# EAGLE schematic lora (EAGLE 6.5.0)
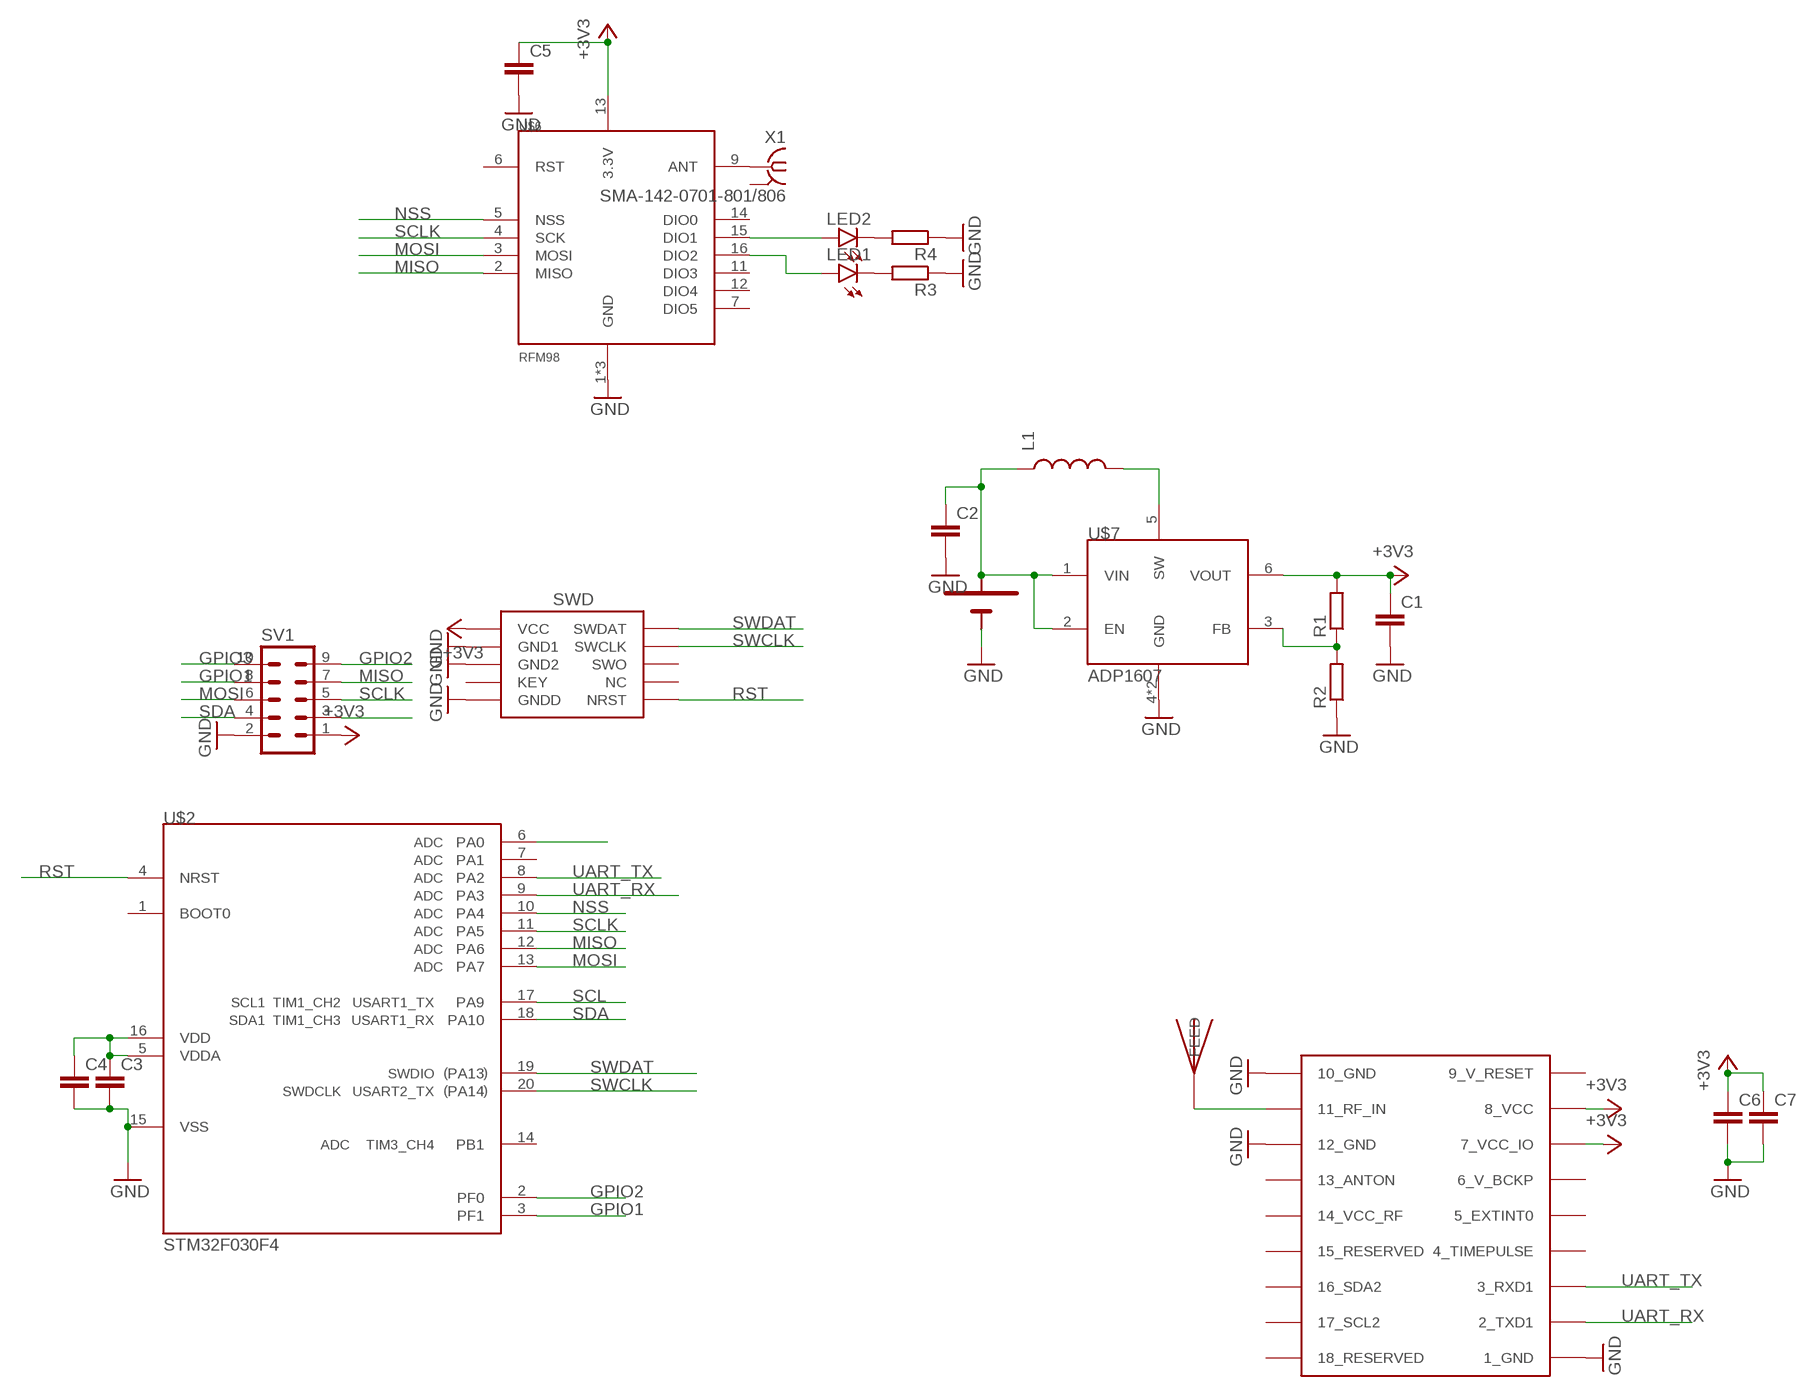
[diagram p0: schematic, sheet 1]

## Parts
C1  C-EUC0805  [C0805]
C2  C-EUC0805  [C0805]
C3  C-EUC0603  [C0603]
C4  C-EUC0603  [C0603]
C5  C-EUC0603  [C0603]
C6  C-EUC0603  [C0603]
C7  C-EUC0603  [C0603]
J1  SWD_PTH_SHROUD  [SWD_PTH_SHROUD]
L1  INDUCTOR0805  [0805]
LED1  LED0603  [LED-0603]
LED2  LED0603  [LED-0603]
R1  R-EU_R0603  [R0603]
R2  R-EU_R0603  [R0603]
R3  R-EU_R0603  [R0603]
R4  R-EU_R0603  [R0603]
SV1  ML10  [ML10]
U$1  KEYSTONE-53  [KEYSTONE53]
U$2  STM32F030F4  [TSSOP20]
U$3  UBLOX_MAX  [UBLOX_MAX]
U$4  JTI_ANTENNA-1575AT43A40  [JTI_ANTENNA-1575AT43A40]
U$6  RFM98  [RFM97]
U$7  ADP1607  [LFCSP6]
X1  SMA-142-0701-801/806  [J502-ND-142-0701-801/806]

## Nets
+3V3: C1.1 C5.1 C6.1 C7.1 J1.1(VCC) R1.2 SV1.1 U$3.7_VCC_IO U$3.8_VCC U$6.13(3.3V) U$7.6(VOUT)
GND: C1.2 C2.2 C3.2 C4.2 C5.2 C6.2 C7.2 J1.3(GND1) J1.5(GND2) J1.9(GNDD) R2.1 R3.1 R4.1 SV1.2 U$1.N1(-) U$1.N2(-) U$2.15(VSS) U$3.1_GND U$3.10_GND U$3.12_GND U$6.1(GND) U$6.8(GND) U$6.10(GND) U$7.4(GND) U$7.EP(GND)
GPIO1: SV1.8 U$2.3(PF1)
GPIO2: SV1.9 U$2.2(PF0)
GPIO3: SV1.10 U$2.6(PA0)
MISO: SV1.7 U$2.12(PA6) U$6.2(MISO)
MOSI: SV1.6 U$2.13(PA7) U$6.3(MOSI)
N$1: U$3.11_RF_IN U$4.FEED
N$2: U$6.9(ANT) X1.1
N$3: L1.2 U$7.5(SW)
N$4: C2.1 L1.1 U$1.P1(+) U$1.P2(+) U$7.1(VIN) U$7.2(EN)
N$5: LED1.C R3.2
N$6: R1.1 R2.2 U$7.3(FB)
N$7: LED2.C R4.2
N$8: LED2.A U$6.15(DIO1)
N$11: C3.1 C4.1 U$2.5(VDDA) U$2.16(VDD)
N$12: LED1.A U$6.16(DIO2)
NSS: U$2.10(PA4) U$6.5(NSS)
RST: J1.10(NRST) U$2.4(NRST)
SCL: SV1.3 U$2.17(PA9)
SCLK: SV1.5 U$2.11(PA5) U$6.4(SCK)
SDA: SV1.4 U$2.18(PA10)
SWCLK: J1.4(SWCLK) U$2.20(PA14)
SWDAT: J1.2(SWDAT) U$2.19(PA13)
UART_RX: U$2.9(PA3) U$3.2_TXD1
UART_TX: U$2.8(PA2) U$3.3_RXD1
Unconnected: J1.6(SWO) J1.7(KEY) J1.8(NC) U$2.1(BOOT0) U$2.7(PA1) U$2.14(PB1) U$3.4_TIMEPULSE U$3.5_EXTINT0 U$3.6_V_BCKP U$3.13_ANTON U$3.14_VCC_RF U$3.15_RESERVED U$3.16_SDA2 U$3.17_SCL2 U$3.18_RESERVED U$6.6(RST) U$6.7(DIO5) U$6.11(DIO3) U$6.12(DIO4) U$6.14(DIO0) X1.G@1 X1.G@2 X1.G@3 X1.G@4

## Power pins joined to a net without a drawn wire
9_V_RESET: U$3.9_V_RESET

## Library data of the parts
C1-C7 = rcl:C-EU: CAPACITOR, European symbol
J1 = dtb:SWD_PTH_SHROUD
L1 = SparkFun-Passives:INDUCTOR: Inductors Basic Inductor/Choke - 0603 and 1206. Footprints are not proven and vary greatly between part numbers. SRN6045- 33uH, 20% 1.4A SDR0403-560KL - 56uH, 10%, 500mA RMS/740mA peak
LED1 LED2 = SparkFun-LED:LED: LEDs Standard schematic elements and footprints for 5mm, 3mm, 1206, and 0603 sized LEDs. 5mm - Spark Fun Electronics SKU : COM-00529 (and others)
R1-R4 = rcl:R-EU_: RESISTOR, European symbol
SV1 = con-ml:ML10: HARTING; OC_FARNELL: unknown; OC_NEWARK: unknown
U$1 = Mine:KEYSTONE-53
U$2 = dtb:STM32F030F4
U$3 = Ava:UBLOX_MAX: UBLOX MAX
U$4 = Ava:JTI_ANTENNA-1575AT43A40
U$6 = Mine:RFM98
U$7 = Mine:ADP1607
X1 = con-coax:SMA-: SMA 50 Ohm End Launch Jack Receptacle - Round Contact Johnson Components Source: www.johnsoncomponents.com .. J502-ND.pdf; MF: JOHNSON COMPONENTS; MPN: 142-0701-801; OC_FARNELL: 1608592; OC_NEWARK: 90F2624